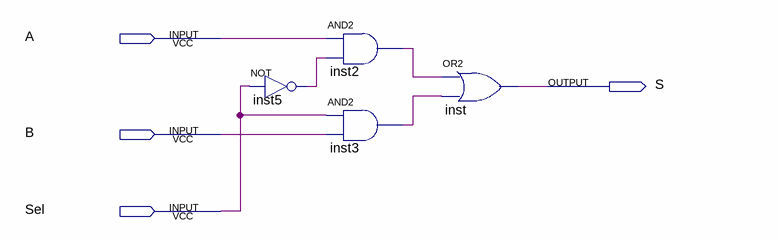
[diagram p0: schematic sheet]
// Quartus schematic MUX2x1.bdf as structural Verilog: 4 symbols, 4 pins
module MUX2x1 (
  input  A,
  input  B,
  input  Sel,
  output S
);

  wire inst2_out, inst3_out, inst5_out;

  not inst5 (inst5_out, Sel);
  and inst2 (inst2_out, A, inst5_out);
  and inst3 (inst3_out, Sel, B);
  or inst (S, inst2_out, inst3_out);
endmodule
